# EAGLE schematic box-100-68-esp32 (EAGLE 9.6.2)
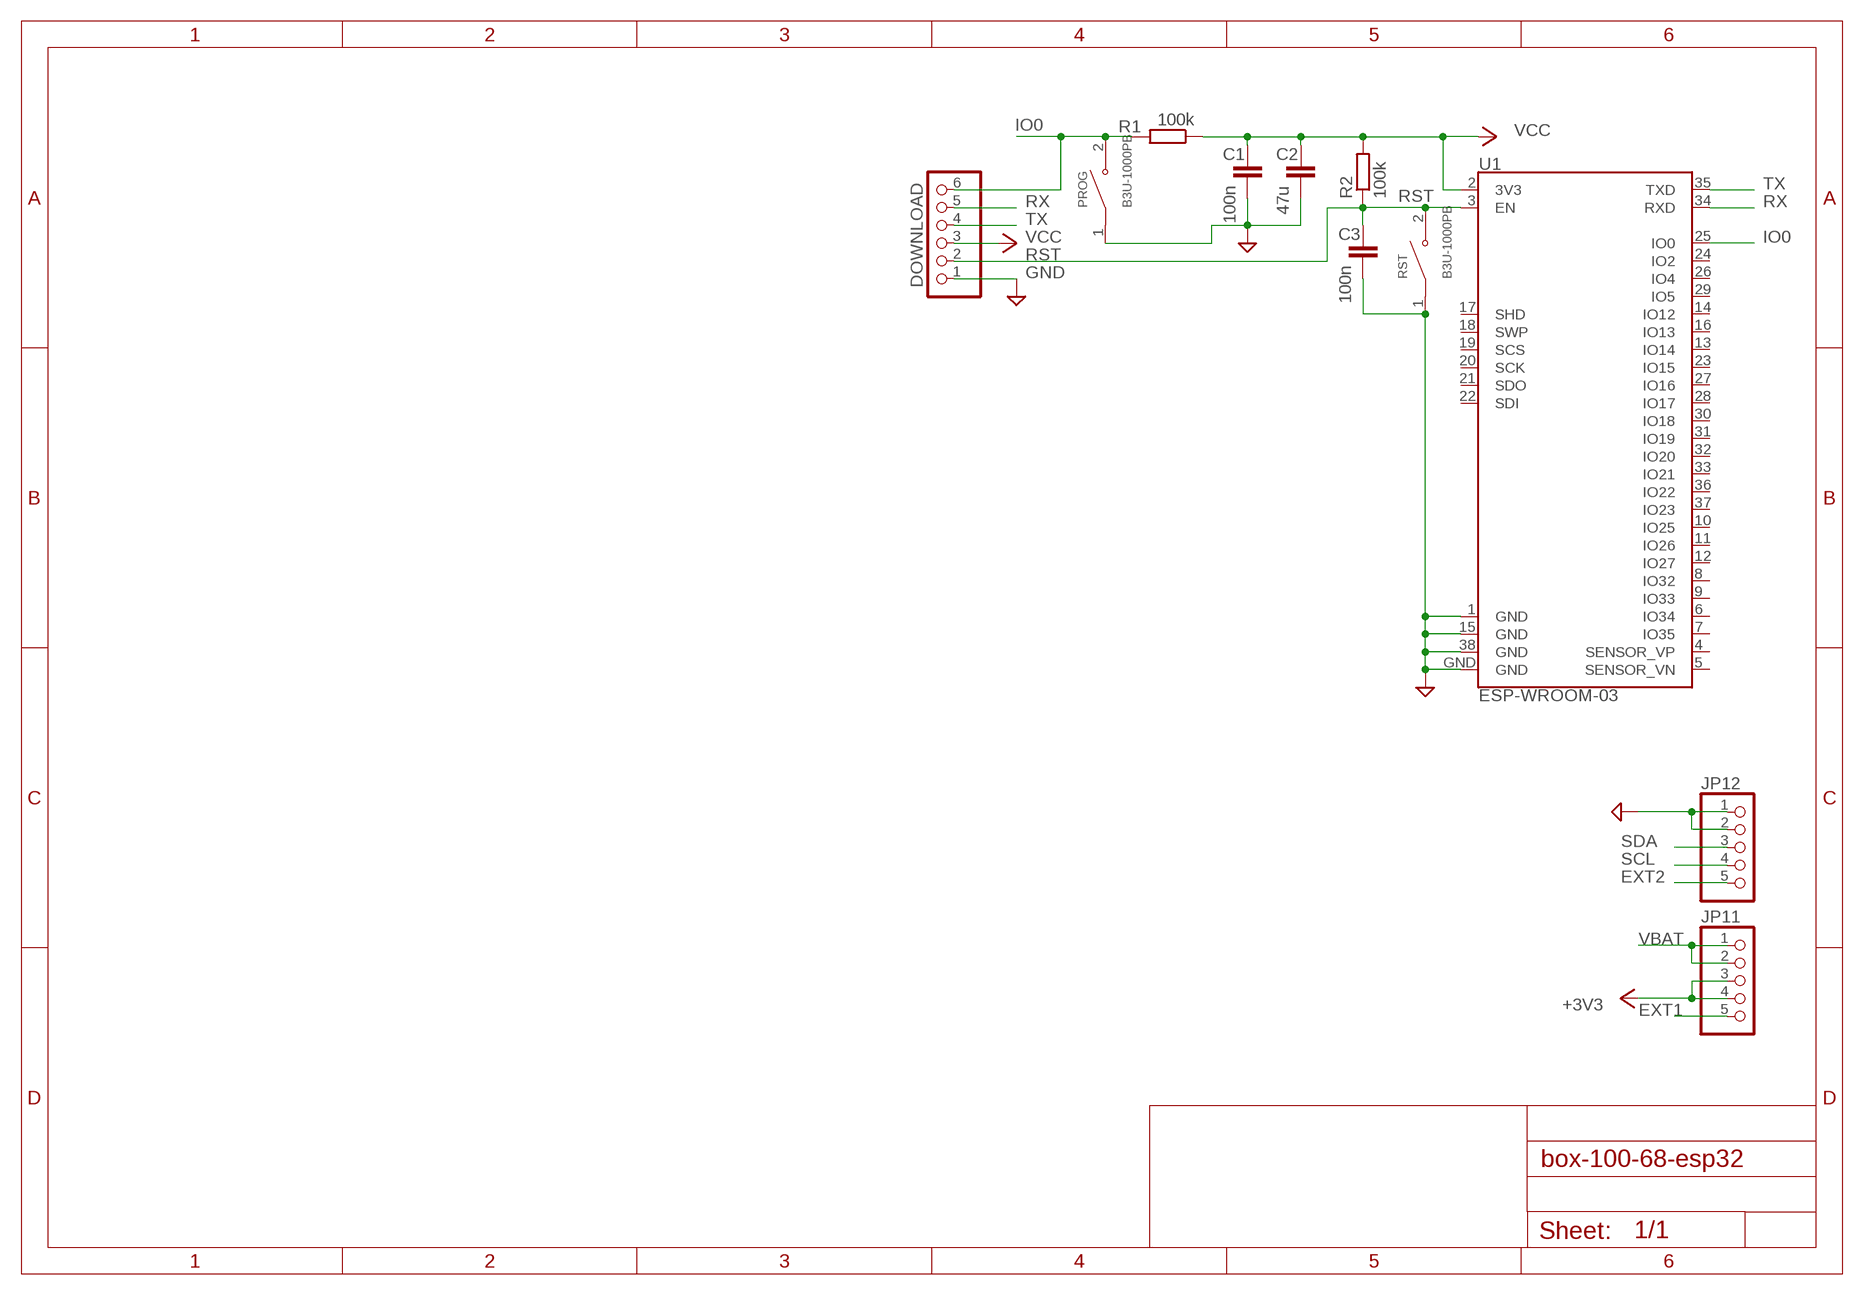
[diagram p0: schematic, sheet 1]

## Parts
C1  100n  C  [C0805]
C2  47u  C  [C0805]
C3  100n  C  [C0805]
DOWNLOAD  PINHD-1X6S  [1X06S]
JP11  PINHD-1X5S  [1X05S]
JP12  PINHD-1X5S  [1X05S]
PROG  B3U-1000PB  [SW_B3U-1000PB]
R1  100k  RR1206  [R1206]
R2  100k  RR1206  [R1206]
RST  B3U-1000PB  [SW_B3U-1000PB]
U1  ESP-WROOM-03  [ESP-WROOM-03]

## Nets
+3V3: JP11.3 JP11.4
EXT1: JP11.5
EXT2: JP12.5
GND: C1.2 C2.2 C3.2 DOWNLOAD.1 JP12.1 JP12.2 PROG.1 RST.1 U1.1(GND) U1.15(GND) U1.38(GND) U1.GND
IO0: DOWNLOAD.6 PROG.2 R1.2 U1.25(IO0)
RST: C3.1 DOWNLOAD.2 R2.1 RST.2 U1.3(EN)
RX: DOWNLOAD.5 U1.34(RXD)
SCL: JP12.4
SDA: JP12.3
TX: DOWNLOAD.4 U1.35(TXD)
VBAT: JP11.1 JP11.2
VCC: C1.1 C2.1 DOWNLOAD.3 R1.1 R2.2 U1.2(3V3)
Unconnected: U1.4(SENSOR_VP) U1.5(SENSOR_VN) U1.6(IO34) U1.7(IO35) U1.8(IO32) U1.9(IO33) U1.10(IO25) U1.11(IO26) U1.12(IO27) U1.13(IO14) U1.14(IO12) U1.16(IO13) U1.17(SHD) U1.18(SWP) U1.19(SCS) U1.20(SCK) U1.21(SDO) U1.22(SDI) U1.23(IO15) U1.24(IO2) U1.26(IO4) U1.27(IO16) U1.28(IO17) U1.29(IO5) U1.30(IO18) U1.31(IO19) U1.32(IO20) U1.33(IO21) U1.36(IO22) U1.37(IO23)

## Library data of the parts
C1-C3 = eagle-ltspice:C: CAPACITOR, European symbol; SPICEMODEL: NONE; SPICEPREFIX: C
DOWNLOAD = pinheadCP:PINHD-1X6: PIN HEADER
JP11 JP12 = pinheadCP:PINHD-1X5: PIN HEADER
PROG RST = SnapEDA-Library2:B3U-1000P: Switch Tactile N.O. SPST Round Button Gull Wing 0.05A 12VDC 1.5N SMD Embossed T/R
R1 R2 = eagle-ltspice:R: RESISTOR, European symbol; SPICEMODEL: NONE; SPICEPREFIX: R
U1 = esp32-sparkfun (1):ESP-WROOM-03; OC_FARNELL: unknown